# EasyEDA Pro project 接收器.epro

# Schematic 接收器原理图
Board Name: 接收板; Create Date: 2024-08-21
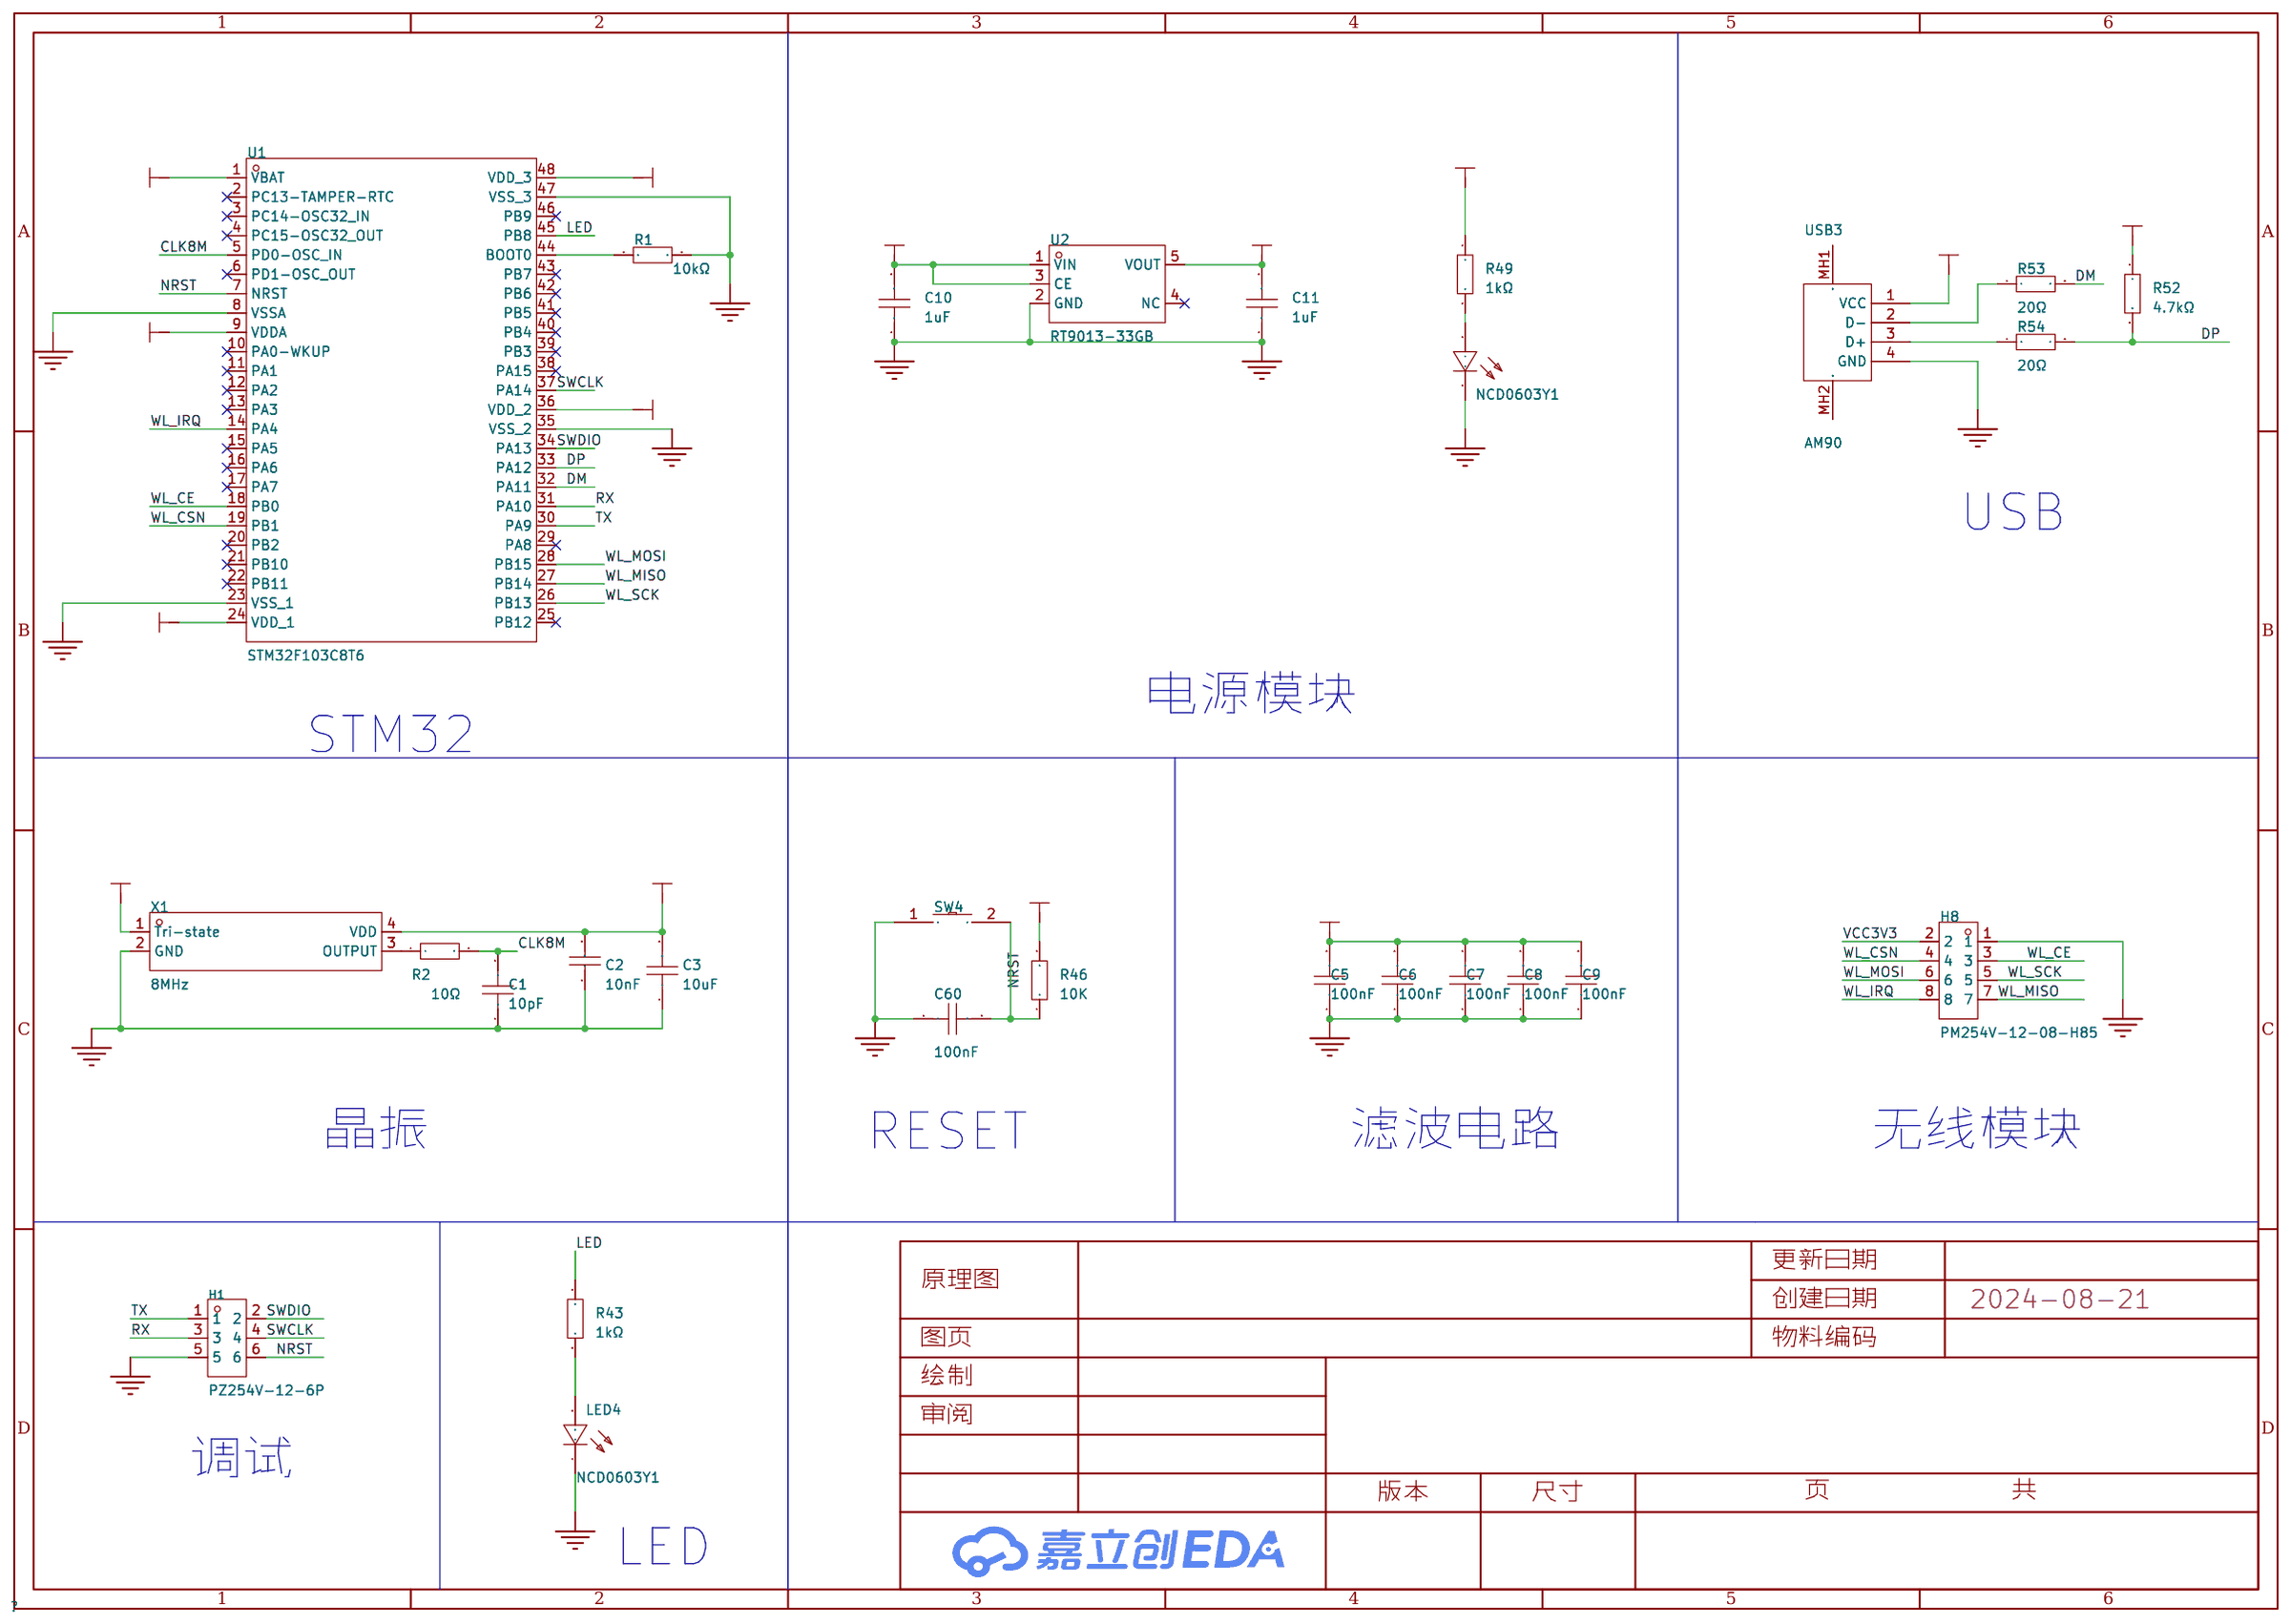
[diagram p0: schematic sheet]

## Parts
C1  10pF  [C0603]
C2  10nF  [C0603]
C3  10uF  [C0603]
C5  100nF  [C0603]
C6  100nF  [C0603]
C7  100nF  [C0603]
C8  100nF  [C0603]
C9  100nF  [C0603]
C10  1uF  [C0603]
C11  1uF  [C0603]
C60  100nF  [C0603]
H1  PZ254V-12-6P  [HDR-TH_6P-P2.54-V-M-R2-C3-S2.54]
H8  PM254V-12-08-H85  [HDR-TH_8P-P2.54-V-F-R2-C4-S2.54]
LED4  NCD0603Y1  [LED0603-RD]
LED9  NCD0603Y1  [LED0603-RD]
R1  10kΩ  [R0603]
R2  10Ω  [R0603]
R43  1kΩ  [R0603]
R46  10K  [R0603]
R49  1kΩ  [R0603]
R52  4.7kΩ  [R0603]
R53  20Ω  [R0603]
R54  20Ω  [R0603]
SW4  TS-1101-C-W  [SW-SMD_L6.0-W3.3-LS8.0]
U1  STM32F103C8T6  [LQFP-48_L7.0-W7.0-P0.50-LS9.0-BL]
U2  RT9013-33GB  [SOT-23-5_L2.9-W1.6-P0.95-LS2.8-BR]
USB3  AM90  [USB-AM-TH_AM90]
X1  8MHz  [OSC-SMD_4P-L3.2-W2.5-BL_SIT8008BI]

## Library data of the parts
C1 = 0603CG100J500NT: 容值:10pF;精度:±5%;额定电压:50V;材质(温度系数):C0G;; LCSC Part Name: 10pF ±5% 50V; Supplier Part: C91367; Manufacturer: FH(风华); Supplier Footprint: 0603; JLCPCB Part Class: 扩展库; Datasheet: https://atta.szlcsc.com/upload/public/pdf/source/20200305/C486355_26A10D38EF8C2A5C37091D0039909270.pdf; Supplier: LCSC; Tolerance: ±5%; Voltage Rated: 50V; Temperature Coefficient: C0G
C2 = 0603B103K500NT: 容值:10nF;精度:±10%;额定电压:50V;材质(温度系数):X7R;; LCSC Part Name: 10nF ±10% 50V; Supplier Part: C57112; Manufacturer: FH(风华); Supplier Footprint: 0603; JLCPCB Part Class: 基础库; Datasheet: https://atta.szlcsc.com/upload/public/pdf/source/20200305/C486355_26A10D38EF8C2A5C37091D0039909270.pdf; Supplier: LCSC; Tolerance: ±10%; Voltage Rated: 50V; Temperature Coefficient: X7R
C3 = CL10A106KP8NNNC: 容值:10uF;精度:±10%;额定电压:10V;材质(温度系数):X5R;; LCSC Part Name: 10uF ±10% 10V; Supplier Part: C19702; Manufacturer: SAMSUNG(三星); Supplier Footprint: 0603; JLCPCB Part Class: 基础库; Datasheet: https://atta.szlcsc.com/upload/public/pdf/source/20160218/1457707763339.pdf; Supplier: LCSC; Tolerance: ±10%; Voltage Rated: 10V; Temperature Coefficient: X5R
C5-C9 = CC0603KRX7R9BB104: 容值:100nF;精度:±10%;额定电压:50V;材质(温度系数):X7R;; LCSC Part Name: 100nF ±10% 50V; Supplier Part: C14663; Manufacturer: YAGEO(国巨); Supplier Footprint: 0603; JLCPCB Part Class: 基础库; Datasheet: https://atta.szlcsc.com/upload/public/pdf/source/20180910/C282072_33301C7F631E79921B82A8DAC6BCC5B3.pdf; Supplier: LCSC; Tolerance: ±10%; Voltage Rated: 50V; Temperature Coefficient: X7R
C10 C11 = CL10A105KB8NNNC: 容值:1uF;精度:±10%;额定电压:50V;材质(温度系数):X5R;; LCSC Part Name: 1uF ±10% 50V; Supplier Part: C15849; Manufacturer: SAMSUNG(三星); Supplier Footprint: 0603; JLCPCB Part Class: 基础库; Datasheet: https://atta.szlcsc.com/upload/public/pdf/source/20160218/1457707763339.pdf; Supplier: LCSC; Tolerance: ±10%; Voltage Rated: 50V; Temperature Coefficient: X5R
C60 = CAP_0603: Supplier Footprint: 0603
H1 = PZ254V-12-6P: 插针结构:2x3P;间距:2.54mm;行距:2.54mm;圆针/方针:方针;安装类型:直插;排数:双排;总PIN位数:6P;额定电流:-;额定电压:-;配合针长度:6mm;塑高:2.5mm;端接针长度:3mm;触头材质:黄铜;触头镀层:-;工作温度范围:-40℃~+105℃;颜色:黑色;; LCSC Part Name: 间距:2.54mm 2x3P 直插 方针; Supplier Part: C492420; Manufacturer: XFCN(兴飞); Supplier Footprint: 插件,P=2.54mm; JLCPCB Part Class: 扩展库; Datasheet: https://atta.szlcsc.com/upload/public/pdf/source/20200309/C492420_BAECB307B001054C09D200388220EAE6.pdf; Supplier: LCSC; Pin Structure: 2x3P; Pitch: 2.54mm; Row Spacing: 2.54mm; Circluar Pins/Square Pins: 方针; Mounting Type: 直插; Number of Rows: 双排; Number of Pins: 6P; Length of Mating Pin: 6mm; Insulation Height: 2.5mm; Length of End Connection Pin: 3mm; Contact Material: 黄铜; Operating Temperature Range: -40℃~+105℃; Color: 黑色
H8 = PM254V-12-08-H85: 插孔结构:2x4P;间距:2.54mm;行距:2.54mm;圆孔/方孔:方孔;安装类型:直插;排数:双排;总孔位数:8P;额定电流:3A;额定电压:250V;插孔方向:顶部;塑高:8.5mm;工作温度范围:-40℃~+105℃;; LCSC Part Name: 间距:2.54mm 2x4P 直插; Supplier Part: C2834799; Manufacturer: XFCN(兴飞); Supplier Footprint: 插件,P=2.54mm; JLCPCB Part Class: 扩展库; Datasheet: https://atta.szlcsc.com/upload/public/pdf/source/20200309/C492399_8C441E2934FBB604A89B37A68AA45ECF.pdf; Supplier: LCSC; Holes Structure: 2x4P; Pitch: 2.54mm; Row Spacing: 2.54mm; Circular Hole / Square Hole: 方孔; Mounting Type: 直插; Number of Rows: 双排; Number of Holes: 8P; Current Rating (Max): 3A; Voltage Rating (Max): 250V; Holes Direction: 顶部; Insulation Height: 8.5mm; Operating Temperature Range: -40℃~+105℃
LED4 LED9 = NCD0603Y1: 发光颜色:黄色;功率:65mW;透镜颜色:无色透明;主波长:586nm~595nm;发光强度:80mcd~220mcd;发光角度:130°;工作温度:-30℃~+85℃;; LCSC Part Name: 黄灯 0603黄灯    正贴; Supplier Part: C84268; Manufacturer: 国星光电; Supplier Footprint: 0603; JLCPCB Part Class: 扩展库; Datasheet: https://atta.szlcsc.com/upload/public/pdf/source/20200820/C84268_8FC106CB292CF978F9CFC6892464F83C.pdf; Supplier: LCSC; Emitted Color: 黄色; Forward Voltage (VF): 1.6V~2.6V; Forward Current: 20mA; Power Dissipation: 65mW; Lens Color: 无色透明; Dominant Wavelength: 586nm~595nm; Luminous Intensity: 80mcd~220mcd; Viewing Angle: 130°; Operating Temperature: -30℃~+85℃
R1 = 0603WAF1002T5E: 电阻类型:厚膜电阻;阻值:10kΩ;精度:±1%;功率:100mW;最大工作电压:75V;温度系数:±100ppm/℃;; LCSC Part Name: 厚膜电阻 10kΩ ±1% 100mW; Supplier Part: C25804; Manufacturer: UNI-ROYAL(厚声); Supplier Footprint: 0603; JLCPCB Part Class: 基础库; Datasheet: https://atta.szlcsc.com/upload/public/pdf/source/20200306/C422600_1E6D84923E4A46A82E41ADD87F860B5C.pdf; Supplier: LCSC; Type: 厚膜电阻; Tolerance: ±1%; Power(Watts): 100mW; Overload Voltage (Max): 75V; Temperature Coefficient: ±100ppm/℃; Operating Temperature Range: -55℃~+155℃
R2 = 0603WAF100JT5E: 电阻类型:厚膜电阻;阻值:10Ω;精度:±1%;功率:100mW;最大工作电压:75V;温度系数:±400ppm/℃;; LCSC Part Name: 10Ω ±1% 100mW 厚膜电阻; Supplier Part: C22859; Manufacturer: UNI-ROYAL(厚声); Supplier Footprint: 0603; JLCPCB Part Class: 基础库; Datasheet: https://atta.szlcsc.com/upload/public/pdf/source/20200306/C422600_1E6D84923E4A46A82E41ADD87F860B5C.pdf; Supplier: LCSC; Type: 厚膜电阻; Tolerance: ±1%; Power(Watts): 100mW; Overload Voltage (Max): 75V; Temperature Coefficient: ±400ppm/℃; Operating Temperature Range: -55℃~+155℃
R43 R49 = 0603WAF1001T5E: 电阻类型:厚膜电阻;阻值:1kΩ;精度:±1%;功率:100mW;最大工作电压:75V;温度系数:±100ppm/℃;; LCSC Part Name: 1kΩ ±1% 100mW 厚膜电阻; Supplier Part: C21190; Manufacturer: UNI-ROYAL(厚声); Supplier Footprint: 0603; JLCPCB Part Class: 基础库; Datasheet: https://atta.szlcsc.com/upload/public/pdf/source/20200306/C422600_1E6D84923E4A46A82E41ADD87F860B5C.pdf; Supplier: LCSC; Type: 厚膜电阻; Tolerance: ±1%; Power(Watts): 100mW; Overload Voltage (Max): 75V; Temperature Coefficient: ±100ppm/℃; Operating Temperature Range: -55℃~+155℃
R46 = Res_0603: Supplier Footprint: 0603
R52 = RC0603FR-074K7L: 电阻类型:厚膜电阻;阻值:4.7kΩ;精度:±1%;功率:100mW;最大工作电压:75V;温度系数:±100ppm/℃;; LCSC Part Name: 厚膜电阻 4.7kΩ ±1% 100mW; Supplier Part: C99782; Manufacturer: YAGEO(国巨); Supplier Footprint: 0603; JLCPCB Part Class: 扩展库; Datasheet: https://atta.szlcsc.com/upload/public/pdf/source/20180224/C181757_15194369480721363983.pdf; Supplier: LCSC; Type: 厚膜电阻; Tolerance: ±1%; Power(Watts): 100mW; Overload Voltage (Max): 75V; Temperature Coefficient: ±100ppm/℃; Operating Temperature Range: -55℃~+155℃
R53 R54 = 0603WAF200JT5E: 电阻类型:厚膜电阻;阻值:20Ω;精度:±1%;功率:100mW;最大工作电压:75V;温度系数:±100ppm/℃;; LCSC Part Name: 20Ω ±1% 100mW 厚膜电阻; Supplier Part: C22950; Manufacturer: UNI-ROYAL(厚声); Supplier Footprint: 0603; JLCPCB Part Class: 基础库; Datasheet: https://atta.szlcsc.com/upload/public/pdf/source/20200306/C422600_1E6D84923E4A46A82E41ADD87F860B5C.pdf; Supplier: LCSC; Type: 厚膜电阻; Tolerance: ±1%; Power(Watts): 100mW; Overload Voltage (Max): 75V; Temperature Coefficient: ±100ppm/℃; Operating Temperature Range: -55℃~+155℃
SW4 = TS-1101-C-W: 电路结构:单刀单掷;按钮形状:矩形按钮;作用力:260gf;安装方式:立贴;开关长度:6mm;开关宽度:3.6mm;开关高度:2.5mm;带支架:不带;触点电流:50mA;额定电压(AC):-;额定电压(DC):12V;额定功率:-;绝缘电阻:-;带灯:无;机械寿命:5万次;; LCSC Part Name: 6*3.6*2.5mm 立贴 轻触开关; Supplier Part: C318938; Manufacturer: XKB Connectivity(中国星坤); Supplier Footprint: SMD; JLCPCB Part Class: 扩展库; Datasheet: https://atta.szlcsc.com/upload/public/pdf/source/20200227/C318938_C2E53B1EEDE37D980A33616AC086DE53.pdf; Supplier: LCSC; Circuit: 单刀单掷; Actuator Style: 矩形按钮; Operating Force: 260gf; Mounting Style: 立贴; Switch Length: 6mm; Switch Width: 3.6mm; Switch Height: 2.5mm; Strike Gundam: 不带; Contact Current: 50mA; Voltage Rating (DC): 12V; Actuator/Cap Color: 白色带淡绿; With Lamp: 无; Mechanical Life: 5万次; Operating Temperature: -30℃~+85℃
U1 = STM32F103C8T6: CPU内核:ARM Cortex-M3;CPU最大主频:72MHz;工作电压范围:2V~3.6V;程序存储容量:64KB;程序存储器类型:FLASH;RAM总容量:20KB;GPIO端口数量:37;; LCSC Part Name: STM32F103C8T6 MSL=3; Supplier Part: C8734; Manufacturer: ST(意法半导体); Supplier Footprint: LQFP-48(7x7); JLCPCB Part Class: 扩展库; Datasheet: https://atta.szlcsc.com/upload/public/pdf/source/20220812/8363ACEC51AD55ECEB84799464F7CB85.pdf; Supplier: LCSC; CPU Core: ARM Cortex-M3; CPU Maximum Speed: 72MHz; Operating Voltage Range: 2V~3.6V; Program Storage Size: 64KB; Program Memory Type: FLASH; RAM Size: 20KB; GPIO Ports Number: 37; ADC (Bit): 12bit; Universal Serial Bus: 有; Peripheral/Function: 看门狗；DMA；看门狗；片载温度传感器; Watchdog: 有; Infrared Data Association: 有; Low-Voltage Detect: 有; Direct Memory Access: 有; Internal Oscillator: 有; Operating Temperature Range: -40℃~+85℃
U2 = RT9013-33GB_1: Supplier Part: C19268157; Manufacturer: TECH PUBLIC(台舟); Supplier Footprint: SOT-23-5; Supplier: LCSC
USB3 = AM90: 连接器类型:Type-A;标准:USB 2.0;公母:公;端口数量:1;触点数量:4P;安装方式:弯插;额定电流 - 电源:-;工作温度范围:-;; LCSC Part Name: Type-A 公 弯插; Supplier Part: C404965; Manufacturer: SHOU HAN(首韩); Supplier Footprint: 插件; JLCPCB Part Class: 扩展库; Datasheet: https://atta.szlcsc.com/upload/public/pdf/source/20190722/C404965_9CC10BE28E3F9E5134758D030387C529.pdf; Supplier: LCSC; Connector Type: Type-A; Standard: USB 2.0; Gender: 公; Number of Ports: 1; Number of Contacts: 4P; Mounting Style: 弯插
X1 = S3D8.000000B20F30T: 频率:8MHz;工作电压:3.3V;输出模式:CMOS;频率稳定度:±20ppm;; LCSC Part Name: 8MHz ±20ppm 3.3V CMOS; Supplier Part: C387337; Manufacturer: SCTF(星通时频); Supplier Footprint: SMD3225-4P; JLCPCB Part Class: 扩展库; Datasheet: https://atta.szlcsc.com/upload/public/pdf/source/20220907/15D873D346DB6DC975109CBFB925520E.pdf; Supplier: LCSC; Supply Voltage: 3.3V; Supply Current (Max): 10mA; Output Type: CMOS; Frequency Stability: ±20ppm; Operating Temperature: -40℃~+85℃

## Nets
GND: C1.1 C2.1 C3.1 C5.1 C6.1 C7.1 C8.1 C9.1 C10.1 C11.1 C60.1 H1.5 H8.1 LED4.1(K) LED9.1(K) R1.2 SW4.1 U1.8(VSSA) U1.23(VSS_1) U1.35(VSS_2) U1.47(VSS_3) U2.2(GND) USB3.4(GND) X1.2(GND)
VCC3V3: C2.2 C3.2 C5.2 C6.2 C7.2 C8.2 C9.2 C11.2 H8.2 R46.2 R49.1 U1.1(VBAT) U1.9(VDDA) U1.24(VDD_1) U1.36(VDD_2) U1.48(VDD_3) U2.5(VOUT) X1.1(Tri-state) X1.4(VDD)
CLK8M: C1.2 R2.2 U1.5(PD0-OSC_IN)
DM: R53.2 U1.32(PA11)
DP: R52.2 R54.2 U1.33(PA12)
LED: R43.1 U1.45(PB8)
NRST: C60.2 H1.6 R46.1 SW4.2 U1.7(NRST)
PIVCC5V: C10.2 R52.1 U2.1(VIN) U2.3(CE) USB3.1(VCC)
RX: H1.3 U1.31(PA10)
SWCLK: H1.4 U1.37(PA14)
SWDIO: H1.2 U1.34(PA13)
TX: H1.1 U1.30(PA9)
WL_CE: H8.3 U1.18(PB0)
WL_CSN: H8.4 U1.19(PB1)
WL_IRQ: H8.8 U1.14(PA4)
WL_MISO: H8.7 U1.27(PB14)
WL_MOSI: H8.6 U1.28(PB15)
WL_SCK: H8.5 U1.26(PB13)
$1N3527: R1.1 U1.44(BOOT0)
$1N4154: R53.1 USB3.2(D-)
$1N4159: R54.1 USB3.3(D+)
$1N8034: R2.1 X1.3(OUTPUT)
Net-(LED4-2): LED4.2(A) R43.2
Net-(LED9-2): LED9.2(A) R49.2

Not connected (* = marked no-connect by the designer): U1 2(PC13-TAMPER-RTC)* 3(PC14-OSC32_IN)* 4(PC15-OSC32_OUT)* 6(PD1-OSC_OUT)* 10(PA0-WKUP)* 11(PA1)* 12(PA2)* 13(PA3)* 15(PA5)* 16(PA6)* 17(PA7)* 20(PB2)* 21(PB10)* 22(PB11)* 25(PB12)* 29(PA8)* 38(PA15)* 39(PB3)* 40(PB4)* 41(PB5)* 42(PB6)* 43(PB7)* 46(PB9)*; U2 4(NC)*; USB3 MH1 MH2

## Notes on the sheet
- USB
- 电源模块
- STM32
- 晶振
- RESET
- 滤波电路
- 无线模块
- 调试
- LED

# Board PCB4
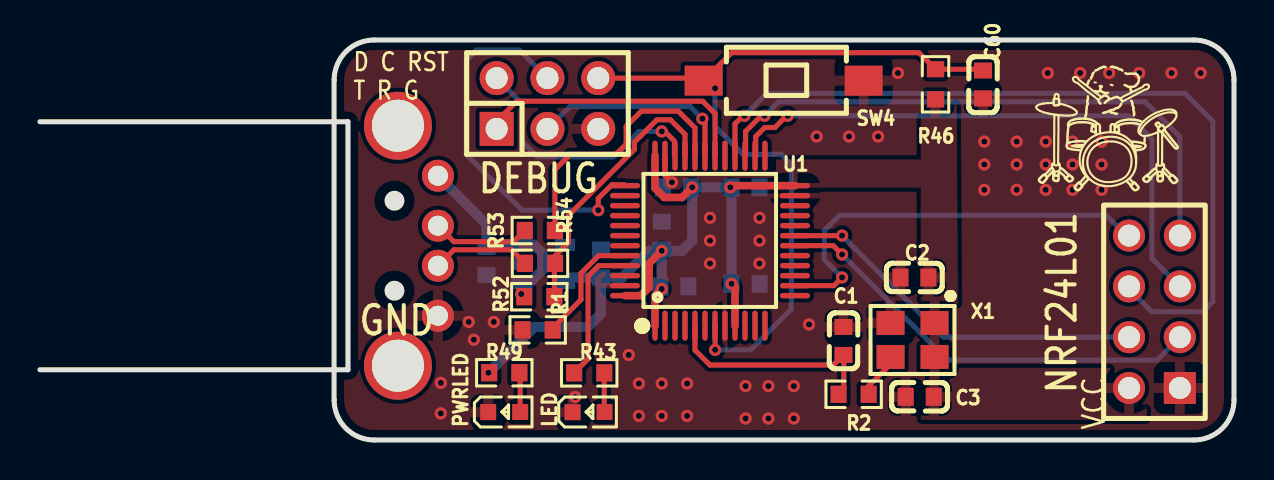
[diagram p1: board, top side]
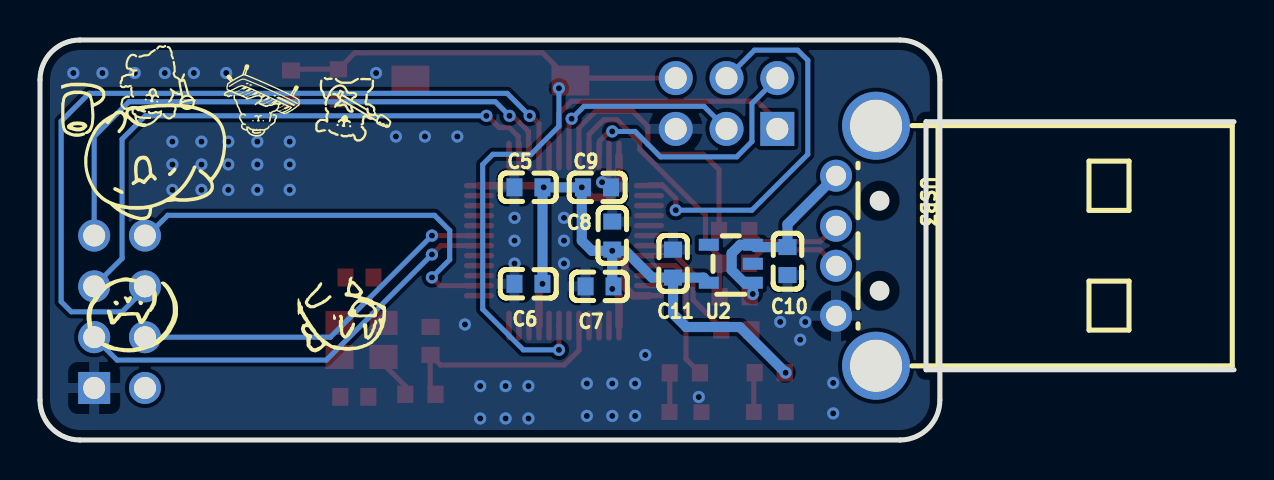
[diagram p2: board, bottom side, seen from below]

Outline 59.71 x 20 mm; copper layers: Top Layer, Bottom Layer. Coordinates in mm from the lower left corner of the outline.
Outline path: 14.71,18 14.71,2 arc(15.29,0.59) 16.71,0 57.71,0 arc(59.12,0.59) 59.71,2 59.71,18 arc(59.12,19.41) 57.71,20 16.71,20 arc(15.29,19.41) 14.71,18
Stack: Top Layer 0.035mm / Dielectric1 1.51mm FR4 er 4.5 / Bottom Layer 0.035mm

## Design rules (mm)
net DP: DP2
net DM: DP2
net $1N4154: DP1
net $1N4159: DP1
template: 自定义配置
spacing copperThickness1oz (default): track to track 0.102, other pairs 0.152 to 0.152
spacing copperThickness2oz: track to track 0.203, other pairs 0.152 to 0.152
track width copperThickness1oz (default): min 0.127, default 0.254, max 2.54
track width copperThickness2oz: min 0.203, default 0.254, max 2.54
differential pair differentialPair (default): width min 0.127, default 0.254, max 2.54; gap min 0.152, default 0.152
via viaSize (default): diameter min 0.5, default 0.61, max 10; hole min 0.3, default 0.305, max 6.3

## Placement (name value [footprint] x y rotation side)
C1  10pF  [C0603]  40.18 4.95 270 top
C2  10nF  [C0603]  43.73 8.12 0 top
C3  10uF  [C0603]  43.99 2.16 0 top
C5  100nF  [C0603]  35.28 12.63 180 bottom
C6  100nF  [C0603]  35.28 7.81 180 bottom
C7  100nF  [C0603]  31.73 7.68 180 bottom
C8  100nF  [C0603]  31.09 10.22 270 bottom
C9  100nF  [C0603]  31.85 12.63 0 bottom
C10  1uF  [C0603]  22.33 8.95 90 bottom
C11  1uF  [C0603]  28.05 8.82 270 bottom
C60  100nF  [C0603]  47.16 17.78 90 top
H1  PZ254V-12-6P  [HDR-TH_6P-P2.54-V-M-R2-C3-S2.54]  25.38 16.83 0 top
H8  PM254V-12-08-H85  [HDR-TH_8P-P2.54-V-F-R2-C4-S2.54]  55.73 6.41 90 top
LED  NCD0603Y1  [LED0603-RD]  27.43 1.39 0 top
PWRLED  NCD0603Y1  [LED0603-RD]  23.21 1.4 0 top
R1  10kΩ  [R0603]  24.89 5.5 180 top
R2  10Ω  [R0603]  40.69 2.29 180 top
R43  1kΩ  [R0603]  27.46 3.36 0 top
R46  10K  [R0603]  44.78 17.78 270 top
R49  1kΩ  [R0603]  23.22 3.36 0 top
R52  4.7kΩ  [R0603]  24.97 7.16 0 top
R53  20Ω  [R0603]  25 10.48 0 top
R54  20Ω  [R0603]  25 8.83 0 top
SW4  TS-1101-C-W  [SW-SMD_L6.0-W3.3-LS8.0]  37.19 17.97 180 top
U1  STM32F103C8T6  [LQFP-48_L7.0-W7.0-P0.50-LS9.0-BL]  33.51 9.97 0 top
U2  RT9013-33GB  [SOT-23-5_L2.9-W1.6-P0.95-LS2.8-BR]  25.16 8.81 180 bottom
USB3  AM90  [USB-AM-TH_AM90]  18.9 9.71 90 bottom
X1  8MHz  [OSC-SMD_4P-L3.2-W2.5-BL_SIT8008BI]  43.63 5 180 top

## Footprints (pads in the part's own frame, mm; a bottom-side part is the same pattern mirrored in y, then rotated)
C0603
  rect 0.8x0.9 smd: 1(-0.7,0) 2(0.7,0)
HDR-TH_6P-P2.54-V-M-R2-C3-S2.54
  rect 1.7x1.7 hole 1.1: 1(-2.54,-1.27)
  round 1.7 hole 1.1: 2(-2.54,1.27) 3(0,-1.27) 4(0,1.27) 5(2.54,-1.27) 6(2.54,1.27)
HDR-TH_8P-P2.54-V-F-R2-C4-S2.54
  rect 1.6x1.6 hole 1.1: 1(-3.81,-1.27)
  round 1.6 hole 1.1: 2(-3.81,1.27) 3(-1.27,-1.27) 4(-1.27,1.27) 5(1.27,-1.27) 6(1.27,1.27) 7(3.81,-1.27) 8(3.81,1.27)
LED0603-RD
  rect 0.8x0.8 smd: 1(-0.799,-0.004) 2(0.799,0.004)
LQFP-48_L7.0-W7.0-P0.50-LS9.0-BL
  oval 0.27x1.5 smd: 1(-2.75,-4.25) 2(-2.25,-4.25) 3(-1.75,-4.25) 4(-1.25,-4.25) 5(-0.75,-4.25) 6(-0.25,-4.25) 7(0.25,-4.25) 8(0.75,-4.25) 9(1.25,-4.25) 10(1.75,-4.25) 11(2.25,-4.25) 12(2.75,-4.25) 25(2.75,4.25) 26(2.25,4.25) 27(1.75,4.25) 28(1.25,4.25) 29(0.75,4.25) 30(0.25,4.25) 31(-0.25,4.25) 32(-0.75,4.25) 33(-1.25,4.25) 34(-1.75,4.25) 35(-2.25,4.25) 36(-2.75,4.25)
  oval 1.5x0.27 smd: 13(4.25,-2.75) 14(4.25,-2.25) 15(4.25,-1.75) 16(4.25,-1.25) 17(4.25,-0.75) 18(4.25,-0.25) 19(4.25,0.25) 20(4.25,0.75) 21(4.25,1.25) 22(4.25,1.75) 23(4.25,2.25) 24(4.25,2.75) 37(-4.25,2.75) 38(-4.25,2.25) 39(-4.25,1.75) 40(-4.25,1.25) 41(-4.25,0.75) 42(-4.25,0.25) 43(-4.25,-0.25) 44(-4.25,-0.75) 45(-4.25,-1.25) 46(-4.25,-1.75) 47(-4.25,-2.25) 48(-4.25,-2.75)
OSC-SMD_4P-L3.2-W2.5-BL_SIT8008BI
  rect 1.4x1.2 smd: 1(-1.1,-0.85) 2(1.1,-0.85) 3(1.1,0.85) 4(-1.1,0.85)
R0603
  rect 0.806x0.864 smd: 1(-0.753,0) 2(0.753,0)
SOT-23-5_L2.9-W1.6-P0.95-LS2.8-BR
  rect 1x0.6 smd: 1(1.1,-0.95) 2(1.1,0) 3(1.1,0.95) 4(-1.1,0.95) 5(-1.1,-0.95)
SW-SMD_L6.0-W3.3-LS8.0
  rect 1.9x1.5 smd: 1(-4,0) 2(4,0)
USB-AM-TH_AM90
  round 1.6 hole 1: 1(3.5,1) 2(1,1) 3(-1,1) 4(-3.5,1)
  round 3.4 hole 2.6: MH1(6,-1) MH2(-6,-1)

## Nets
As in the schematic, except:
GND: C1.1 C2.1 C3.1 C5.1 C6.1 C7.1 C8.1 C9.1 C10.1 C11.1 C60.1 H1.5 H8.1 LED.1 PWRLED.1 R1.2 SW4.1 U1.8 U1.23 U1.35 U1.47 U2.2 USB3.4 X1.2
$1N3682: PWRLED.2 R49.2
$1N8262: LED.2 R43.2

Pads without a net: U1 2 3 4 6 10 11 12 13 15 16 17 20 21 22 25 29 38 39 40 41 42 43 46; U2 4; USB3 MH1 MH2

## Via types
v1: diameter 0.61, hole 0.305, Top Layer to Bottom Layer, 70 vias

## Routing (per net, layer and track width the routed paths; a pad name or vN(x,y) marks a point on that pad's centre or on a via; arc(x,y) is an arc through that point)
GND: length 1.5
  Top Layer w0.254: U1.35 31.26,13.23 v1(31.6,12.89)
  vias: v1(20.04,2.86) v1(20.04,1.33) v1(21.44,5.9) v1(21.69,5.01) v1(22.69,5.9) v1(26.77,2.15) v1(29.44,4.25) v1(29.95,2.82) v1(29.95,1.2) v1(31.09,2.82) v1(31.09,1.2) v1(32.36,2.82) v1(32.36,1.2) v1(33.51,11.11) v1(33.51,9.97) v1(33.51,8.82) v1(35.28,2.7) v1(35.28,1.08) v1(35.98,11.11) v1(35.98,9.97) v1(35.98,8.82) v1(36.43,2.7) v1(36.43,1.08) v1(37.7,2.7) v1(37.7,1.08) v1(38.46,5.78) v1(38.84,15.17) v1(40.46,15.17) v1(41.91,15.17) v1(42.9,18.35) v1(47.22,14.92) v1(47.22,13.78) v1(47.22,12.51) v1(48.84,14.92) v1(48.84,13.78) v1(48.84,12.51) v1(50.29,14.92) v1(50.29,13.78) v1(50.29,12.51) v1(50.4,18.35) v1(51.63,14.92) v1(51.63,13.78) v1(51.63,12.51) v1(52.02,18.35) v1(53.09,14.92) v1(53.09,13.78) v1(53.09,12.51) v1(53.47,18.35) v1(54.97,18.35) v1(56.59,18.35) v1(58.04,18.35)
VCC3V3: length 42.2
  Top Layer w0.381: v1(31.09,7.55) 30.76,7.22 U1.1 ; U1.48 30.05,7.22 30.46,7.63 30.46,8.82 v1(31.09,9.46) ; v1(34.58,7.81) 34.76,7.64 U1.9 ; U1.24 34.6,12.72 v1(34.52,12.63) ; v1(32.62,12.63) 32.11,12.13 31.22,12.13 30.76,12.59 U1.36
  Bottom Layer w0.254: 34.84,12.51 34.58,12.51
  Bottom Layer w0.508: v1(31.09,7.55) v1(31.09,9.46) ; v1(31.09,9.46) 32.11,9.46 32.62,9.97 v1(32.62,12.63) 34.46,12.63 34.58,12.51 v1(34.58,7.81) ; v1(31.09,9.46) 30.44,9.46 29.1,8.12 C11.2 ; U2.5 26.52,8.12 C11.2 ; C11.2 28.05,6.31 27.39,5.65 24.71,5.65 v1(22.42,3.36)
CLK8M: length 11.3
  Top Layer w0.254: U1.5 32.76,4.49 33.5,3.75 39.68,3.75 39.93,4.01 ; R2.2 40.2,2.55 40.2,4.01 39.93,4.01 ; 39.93,4.01 C1.2
DM: length 13.5
  Top Layer w0.254: U1.32 32.76,15.61 31.92,16.44 30.08,16.44 29.31,15.68 29.31,14.79 28.81,14.29 26.52,14.29 25.75,13.51 R53.2
DP: length 13.7
  Top Layer w0.254: R52.2 25.72,8.8 R54.2 25.76,9.2 26.43,9.88 26.43,11.23 29.72,14.52 29.72,14.88 30.85,16.01 31.52,16.01 32.26,15.28 U1.33
LED: length 7.2
  Top Layer w0.254: 26.71,3.36 27.41,4.06 27.41,8.19 27.94,8.72 U1.45
NRST: length 39.8
  Top Layer w0.254: v1(33.76,4.51) 33.76,5.71 U1.7 ; C60.2 47.1,18.54 R46.1 43.96,19.37 34.59,19.37 SW4.2 33.06,18.09 H1.6
  Bottom Layer w0.254: v1(33.76,4.51) 35.54,4.51 37.57,6.54 37.57,13.78 37.06,14.29 35.16,14.29 33.76,15.68 v1(33.76,17.59)
PIVCC5V: length 10.4
  Bottom Layer w0.508: USB3.1 22.33,10.78 C10.2 23.95,9.65 U2.3 24.69,9.76 25.12,9.33 25.12,8.5 24.43,7.81 24.12,7.81 U2.1 v1(24.06,7.3)
RX: length 10.4
  Top Layer w0.254: v1(33.12,16.06) 33.26,15.93 U1.31
  Bottom Layer w0.254: v1(33.12,16.06) 32.5,16.68 26.51,16.68 H1.3
SWCLK: length 19.5
  Top Layer w0.254: U1.37 29.21,12.76 28.6,12.76 27.92,12.08 v1(27.92,11.49)
  Bottom Layer w0.254: H1.4 23.98,19.49 21.82,19.49 21.31,18.98 21.31,14.29 24.11,11.49 v1(27.92,11.49)
SWDIO: length 13.1
  Top Layer w0.254: 31.73,14.25 31.73,14.95 31.24,15.43 v1(31.09,15.43)
  Bottom Layer w0.254: H1.2 24.11,16.83 24.11,14.92 24.87,14.16 28.68,14.16 29.95,15.43 v1(31.09,15.43)
TX: length 14.1
  Top Layer w0.254: U1.30 33.76,14.22 33.76,16.32 33.14,16.94 23.84,16.94 22.84,15.94 H1.1
WL_CE: length 22.1
  Top Layer w0.254: v1(40.11,9.28) 39.67,9.72 U1.18
  Bottom Layer w0.254: H8.3 55.86,4 45.39,4 v1(40.11,9.28)
WL_CSN: length 18.8
  Top Layer w0.254: v1(40.11,10.22) 40.11,10.22 U1.19
  Bottom Layer w0.254: H8.4 45.19,5.14 v1(40.11,10.22)
WL_IRQ: length 21.2
  Top Layer w0.254: U1.14 39.7,7.72 v1(40.11,8.13)
  Bottom Layer w0.254: H8.8 54.33,10.22 53.32,11.24 39.98,11.24 39.22,10.48 39.22,9.02 v1(40.11,8.13)
WL_MISO: length 29.2
  Top Layer w0.254: v1(36.23,16.21) 36.06,16.21 35.28,15.43 35.28,14.25 U1.27
  Bottom Layer w0.254: H8.7 57,15.17 55.26,16.91 36.93,16.91 v1(36.23,16.21)
WL_MOSI: length 40.7
  Top Layer w0.254: U1.28 34.76,15.81 35.15,16.21 v1(35.22,16.21)
  Bottom Layer w0.254: v1(35.22,16.21) 36.35,17.33 57.25,17.33 58.65,15.94 58.65,6.92 58.14,6.41 55.6,6.41 54.46,7.55 H8.6
WL_SCK: length 29.7
  Top Layer w0.254: v1(37.39,16.21) 37.33,16.21 36.75,15.62 36.24,15.62 35.79,15.17 35.79,14.22 U1.26
  Bottom Layer w0.254: v1(37.39,16.21) 54.44,16.21 55.6,15.05 55.6,9.08 H8.5
$1N3527: length 6
  Top Layer w0.254: R1.1 25.64,5.6 27.05,7.02 27.05,8.34 27.93,9.22 U1.44
$1N3682: length 2
  Top Layer w0.254: PWRLED.2 24.01,3.32 R49.2
$1N4154: length 4.9
  Top Layer w0.254: R53.1 23.68,9.92 20.7,9.92 USB3.2
$1N4159: length 5
  Top Layer w0.254: 24.25,8.83 23.57,9.51 20.7,9.51 USB3.3
$1N8034: length 2.3
  Top Layer w0.254: X1.3 42.53,3.79 41.44,2.7 R2.1
$1N8262: length 2
  Top Layer w0.254: LED.2 28.22,1.41 R43.2

## Copper pours and planes (outline as drawn; the poured copper is in the pictures)
GND on Top Layer: 14.33,20.64 60.94,20.64 60.94,-1.34 14.33,-1.34
GND on Bottom Layer: 61.7,-1.84 14.58,-1.84 14.58,22.67 61.7,22.67
VCC3V3 on Top Layer: 44.05,1.01 44.05,12.62 36.93,12.62 36.81,12.74 36.81,14.03 44.05,14.03 44.05,17.48 45.84,17.48 45.93,3.61 55.35,3.61 55.35,1.01

## Text on the board
Top Silkscreen Layer: D C RST / T R G | VCC | NRF24L01 | DEBUG | GND
